# EAGLE design main (EAGLE 7.1.0)
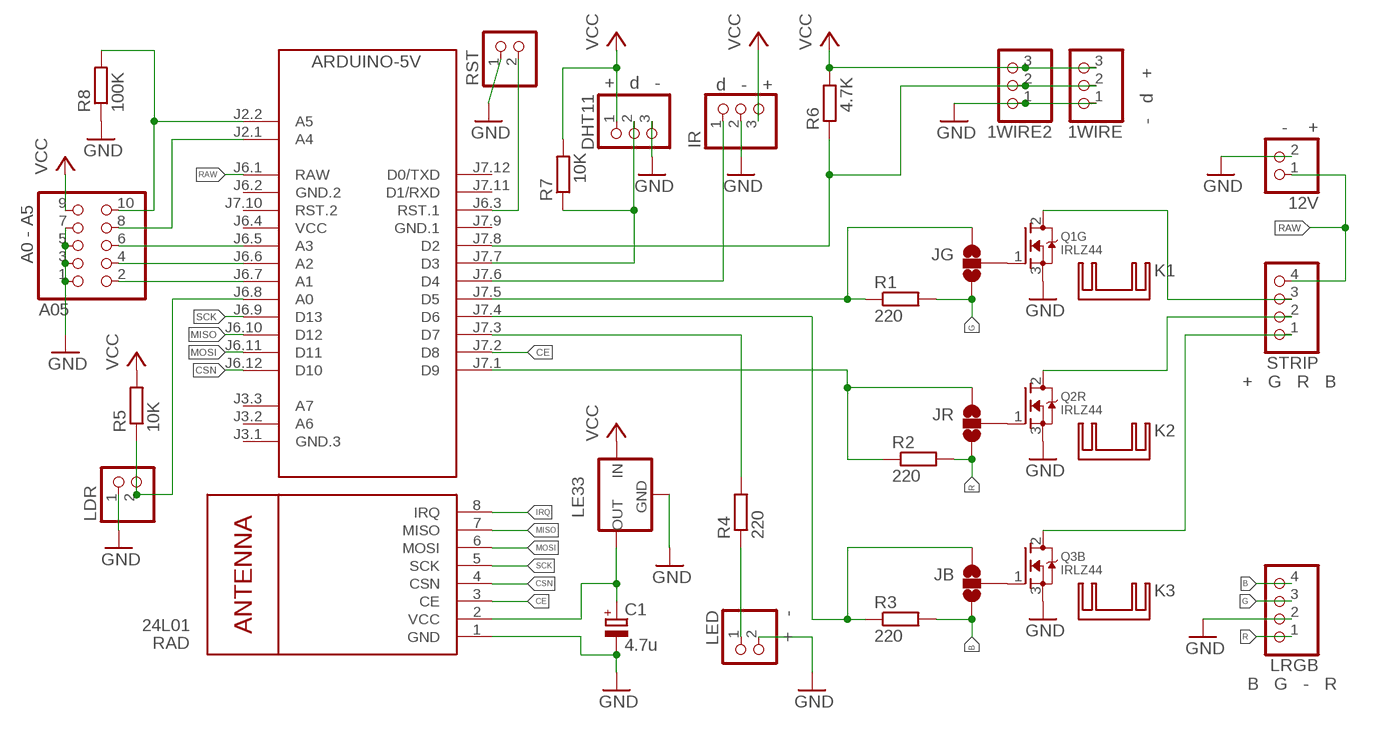
[diagram p0: schematic, sheet 1]

## Parts
1WIRE  - d +  PINHD-1X3  [1X03]
1WIRE2  PINHD-1X3  [1X03]
12V  - +  PINHD-1X2  [1X02]
A05  A0 - A5  PINHD-2X5  [2X05]
ARDUINO-5V  ARDUINO-PRO-MINI-5.0V#NP  [ARDUINO-PRO-MINI#NP]
C1  4.7u  CPOL-EUE5-6  [E5-6]
DHT11  + d -  PINHD-1X3  [1X03]
IR  d - +  PINHD-1X3  [1X03]
JB  SOLDERJUMPER_2WAYS  [SJ_3]
JG  SOLDERJUMPER_2WAYS  [SJ_3]
JR  SOLDERJUMPER_2WAYS  [SJ_3]
K1  D02S  [D02S]
K2  D02S  [D02S]
K3  D02S  [D02S]
LDR  PINHD-1X2  [1X02]
LE33  79LXX  [79LXX]
LED  + -  PINHD-1X2  [1X02]
LRGB  B G - R  PINHD-1X4  [1X04]
Q1G  IRLZ44  MOSFET-NGDS_TO220V  [TO220V]
Q2R  IRLZ44  MOSFET-NGDS_TO220V  [TO220V]
Q3B  IRLZ44  MOSFET-NGDS_TO220V  [TO220V]
R1  220  R-EU_0207/7  [0207/7]
R2  220  R-EU_0207/7  [0207/7]
R3  220  R-EU_0207/7  [0207/7]
R4  220  R-EU_0207/7  [0207/7]
R5  10K  R-EU_0207/7  [0207/7]
R6  4.7K  R-EU_0207/7  [0207/7]
R7  10K  R-EU_0207/7  [0207/7]
R8  100K  R-EU_0207/7  [0207/7]
RAD  24L01  WIRELESS-NRF24L01  [WIRELESS-NRF24L01]
RST  PINHD-1X2  [1X02]
STRIP  + G R B  PINHD-1X4  [1X04]

## Nets
B: JB.3 LRGB.4 R3.2
CE: ARDUINO-5V.J7.2(D8) RAD.3(CE)
CSN: ARDUINO-5V.J6.12(D10) RAD.4(CSN)
G: JG.3 LRGB.3 R1.2
GND: 1WIRE2.1 1WIRE.1 12V.2 A05.1 A05.3 A05.5 A05.7 C1.- DHT11.3 IR.2 LDR.1 LE33.GND LED.2 LRGB.2 Q1G.3(S) Q2R.3(S) Q3B.3(S) R8.1 RAD.1(GND) RST.1
IRQ: RAD.8(IRQ)
MISO: ARDUINO-5V.J6.10(D12) RAD.7(MISO)
MOSI: ARDUINO-5V.J6.11(D11) RAD.6(MOSI)
N$1: JB.2 Q3B.1(G)
N$2: JR.2 Q2R.1(G)
N$3: JG.2 Q1G.1(G)
N$4: ARDUINO-5V.J7.1(D9) JR.1 R2.1
N$5: ARDUINO-5V.J7.4(D6) JB.1 R3.1
N$6: LED.1 R4.1
N$7: ARDUINO-5V.J7.5(D5) JG.1 R1.1
N$8: A05.10 ARDUINO-5V.J2.2(A5) R8.2
N$9: A05.2 ARDUINO-5V.J6.7(A1)
N$10: A05.4 ARDUINO-5V.J6.6(A2)
N$11: Q1G.2(D) STRIP.3
N$12: Q3B.2(D) STRIP.1
N$13: Q2R.2(D) STRIP.2
N$14: 1WIRE2.2 1WIRE.2 ARDUINO-5V.J7.8(D2) R6.1
N$15: ARDUINO-5V.J7.6(D4) IR.1
N$16: C1.+ LE33.OUT RAD.2(VCC)
N$17: A05.6 ARDUINO-5V.J6.5(A3)
N$18: A05.8 ARDUINO-5V.J2.1(A4)
N$19: ARDUINO-5V.J6.8(A0) LDR.2 R5.1
N$20: ARDUINO-5V.J7.3(D7) R4.2
N$21: ARDUINO-5V.J7.7(D3) DHT11.2 R7.1
N$22: ARDUINO-5V.J6.3(RST.1) RST.2
R: JR.3 LRGB.1 R2.2
RAW: 12V.1 ARDUINO-5V.J6.1(RAW) STRIP.4
SCK: ARDUINO-5V.J6.9(D13) RAD.5(SCK)
VCC: 1WIRE2.3 1WIRE.3 A05.9 DHT11.1 IR.3 LE33.IN R5.2 R6.2 R7.2
Unconnected: ARDUINO-5V.J3.1(GND.3) ARDUINO-5V.J3.2(A6) ARDUINO-5V.J3.3(A7) ARDUINO-5V.J7.10(RST.2) ARDUINO-5V.J7.11(D1/RXD) ARDUINO-5V.J7.12(D0/TXD)

## Power pins joined to a net without a drawn wire
GND.1: ARDUINO-5V.J7.9(GND.1)
GND.2: ARDUINO-5V.J6.2(GND.2)
VCC: ARDUINO-5V.J6.4(VCC)

## Library data of the parts
1WIRE 1WIRE2 DHT11 IR = pinhead:PINHD-1X3: PIN HEADER
12V LDR LED RST = pinhead:PINHD-1X2: PIN HEADER
A05 = pinhead:PINHD-2X5: PIN HEADER
ARDUINO-5V = diy-modules:ARDUINO-PRO-MINI-*#NP: Arduino Pro Mini without programming pads
C1 = rcl:CPOL-EU: POLARIZED CAPACITOR, European symbol
JB JG JR = MD-Passives:SOLDERJUMPER_2WAY: Solder Jumper 2 way solder jumper
K1-K3 = heatsink:D02S: HEATSINK distributor Schukat
LE33 = v-reg-2:79LXX: VOLTAGE REGULATOR
LRGB STRIP = pinhead:PINHD-1X4: PIN HEADER
Q1G Q2R Q3B = adafruit:MOSFET-N: N-Channel Mosfet 2N7002E - 60V 260mA SOT23 [Digikey: 2N7002ET1GOSTR-ND] - REEL BSH103 - 30V 850mA SOT23 [Digikey: 568-5013-1-ND]
R1-R8 = rcl:R-EU_: RESISTOR, European symbol
RAD = diy-modules:WIRELESS-NRF24L01: 2.4 GHz Wireless Module based on NRF24L01 chip

## Board
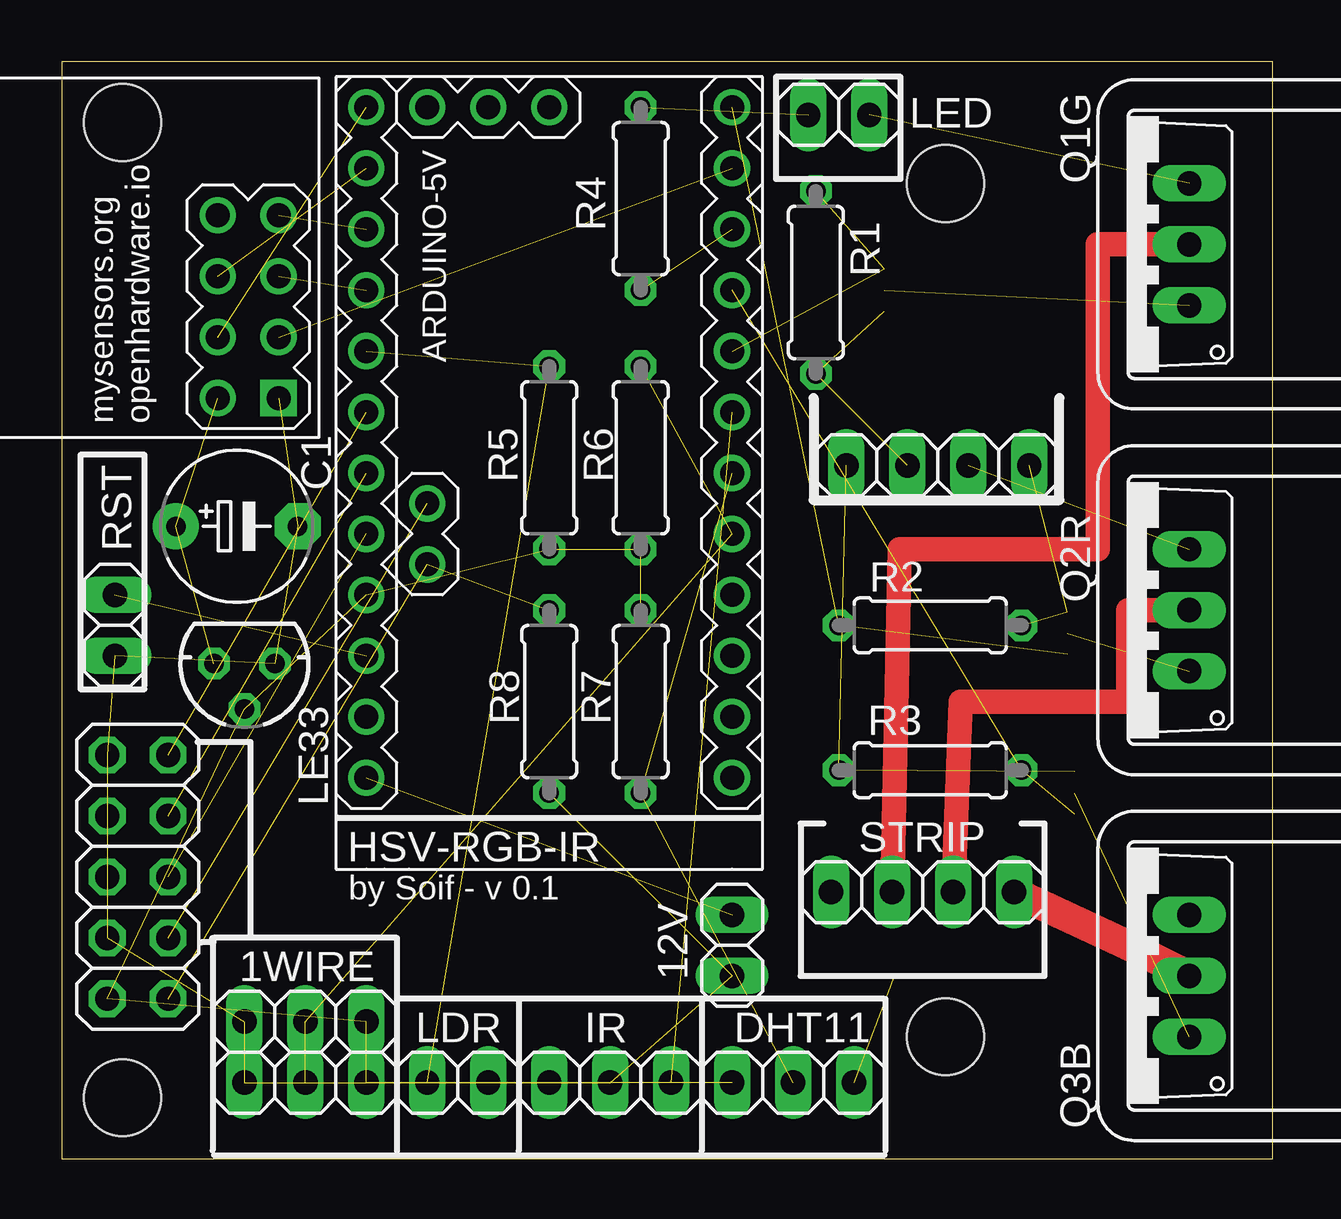
[diagram p1: board, top side]
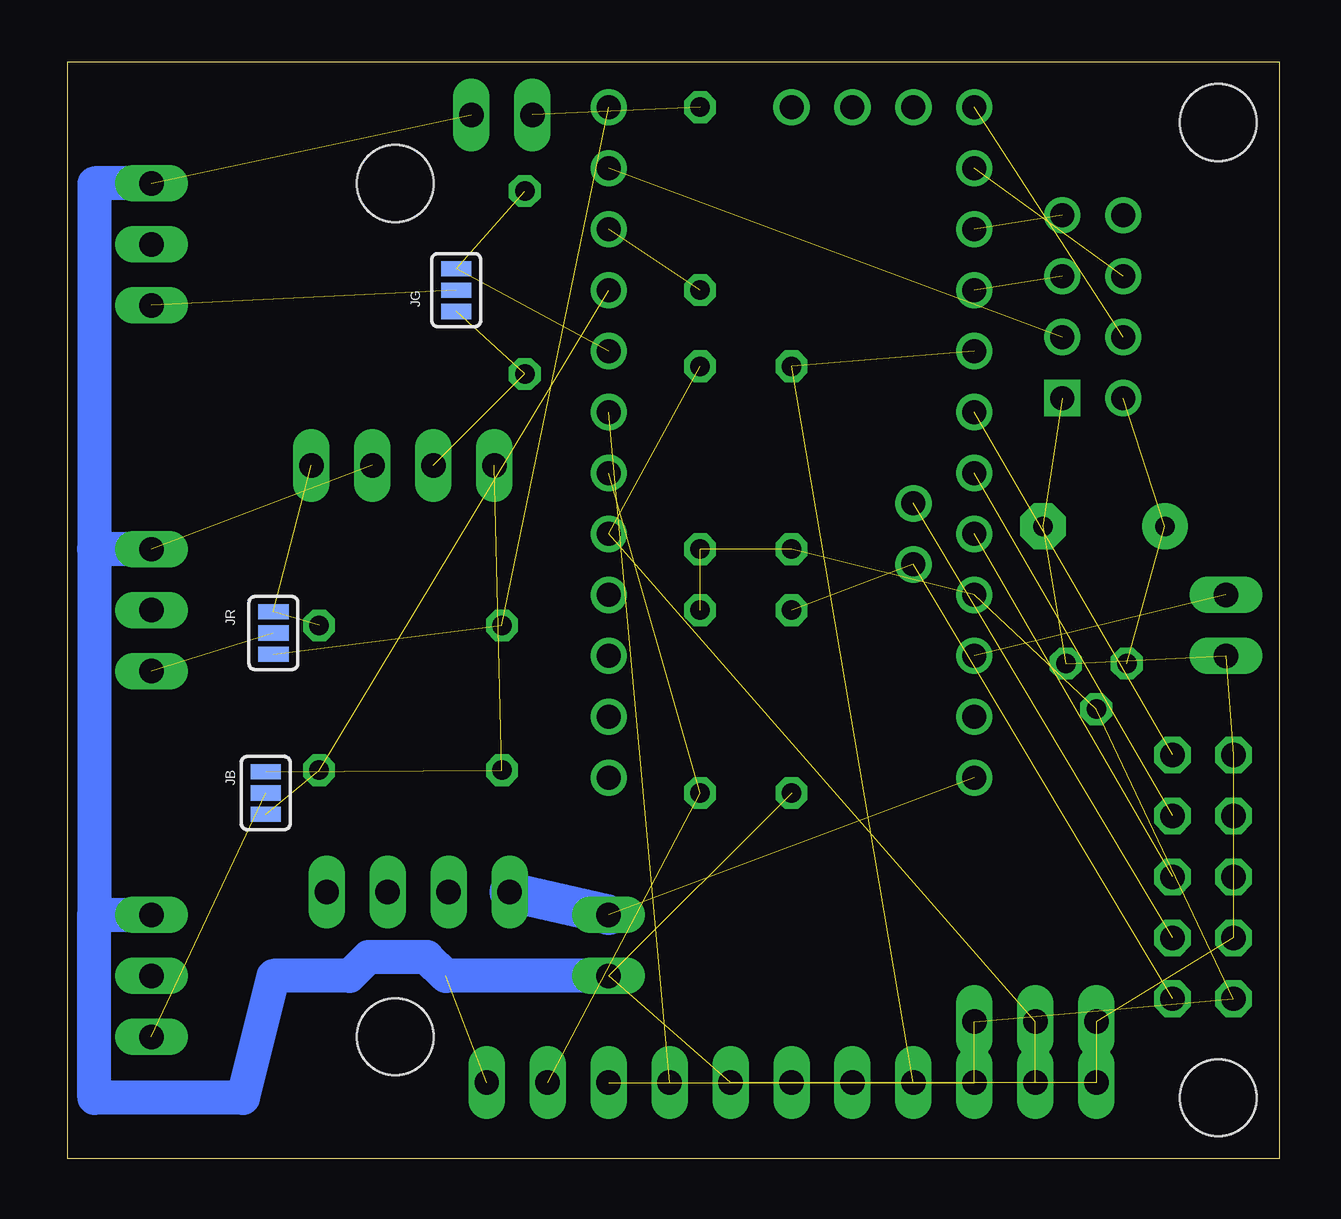
[diagram p2: board, bottom side, seen from below]

Size 50.47 x 45.71 mm. Coordinates in mm from the lower left corner, seen from the top.
Outline: 0,0 50.47,0 50.47,45.71 0,45.71 0,0
Copper layers (1*16): Top 0.035mm / dielectric 1.5mm / Bottom 0.035mm
Design rules "default": minimum track width 10mil, minimum drill 24mil, track to track 8mil, track to pad 8mil, pad to pad 8mil, via to via 8mil, smd to smd 8mil, copper to edge 40mil, drill to drill 8mil, minimum pad ring 10mil, minimum via ring 8mil, stop-mask expansion 4mil, vias tented up to drill 0mil, thermal gap 10mil
Holes 3.2 mm at 36.83,40.64 36.83,5.08 2.54,2.54 2.54,43.18

### Footprints (pad centres in the part's own frame; a part is rotated, then mirrored left to right if it is on the bottom)
1X03 = drill 1.016 long: 1 -2.54,0; 2 0,0; 3 2.54,0
1X02 = drill 1.016 long: 1 -1.27,0; 2 1.27,0
2X05 = drill 1.016 octagon: 1 -5.08,-1.27; 2 -5.08,1.27; 3 -2.54,-1.27; 4 -2.54,1.27; 5 0,-1.27; 6 0,1.27; 7 2.54,-1.27; 8 2.54,1.27; 9 5.08,-1.27; 10 5.08,1.27
ARDUINO-PRO-MINI#NP = drill 1: J2.1 -1.27,5.08; J2.2 -3.81,5.08; J3.1 15.24,0; J3.2 15.24,2.54; J3.3 15.24,5.08; J6.1 -12.7,7.62; J6.2 -10.16,7.62; J6.3 -7.62,7.62; J6.4 -5.08,7.62; J6.5 -2.54,7.62; J6.6 0,7.62; J6.7 2.54,7.62; J6.8 5.08,7.62; J6.9 7.62,7.62; J6.10 10.16,7.62; J6.11 12.7,7.62; J6.12 15.24,7.62; J7.1 15.24,-7.62; J7.2 12.7,-7.62; J7.3 10.16,-7.62; J7.4 7.62,-7.62; J7.5 5.08,-7.62; J7.6 2.54,-7.62; J7.7 0,-7.62; J7.8 -2.54,-7.62; J7.9 -5.08,-7.62; J7.10 -7.62,-7.62; J7.11 -10.16,-7.62; J7.12 -12.7,-7.62
E5-6 = drill 0.813 pad 1.905: + -2.54,0 | drill 0.813 pad 1.905 octagon: - 2.54,0
SJ_3 = smd 0.635 x 1.27: 1 -0.889,0; 2 0,0; 3 0.889,0
79LXX = drill 0.813 octagon: GND -1.27,0; IN 0,1.905; OUT 1.27,0
1X04 = drill 1.016 long: 1 -3.81,0; 2 -1.27,0; 3 1.27,0; 4 3.81,0
TO220V = drill 1.016 long: 1 -2.54,-2.54; 2 0,-2.54; 3 2.54,-2.54
0207/7 = drill 0.813 octagon: 1 -3.81,0; 2 3.81,0
WIRELESS-NRF24L01 = drill 1 square: 1 1.751,13.386 | drill 1: 2 4.291,13.386; 3 1.751,10.846; 4 4.291,10.846; 5 1.751,8.306; 6 4.291,8.306; 7 1.751,5.766; 8 4.291,5.766

### Placement (x,y rotation side)
1WIRE  10.16,3.18 0 top
1WIRE2  10.16,5.72 0 top
12V  27.94,8.89 270 top
A05  3.17,11.75 270 top
ARDUINO-5V  20.32,28.58 90 top
C1  7.3,26.35 0 top
DHT11  30.48,3.18 0 top
IR  22.86,3.18 180 top
JB  42.23,15.24 90 bottom
JG  34.29,36.2 270 bottom
JR  41.91,21.91 90 bottom
K1  44.45,38.1 270 top
K2  44.45,22.86 270 top
K3  44.45,7.62 270 top
LDR  16.51,3.18 180 top
LE33  7.62,20.64 180 top
LED  32.38,43.5 0 top
LRGB  36.51,28.89 180 top
Q1G  44.45,38.1 90 top
Q2R  44.45,22.86 90 top
Q3B  44.45,7.62 90 top
R1  31.43,36.51 270 top
R2  36.2,22.23 0 top
R3  36.2,16.19 180 top
R4  24.13,40.01 270 top
R5  20.32,29.21 270 top
R6  24.13,29.21 270 top
R7  24.13,19.05 90 top
R8  20.32,19.05 90 top
RAD  10.79,45.09 180 top
RST  2.22,22.23 90 top
STRIP  35.88,11.11 180 top

### Tracks (layer width: path | path; a pad name or v marks a point on that pad's centre or on a via)
B  (2 unrouted)
CE  (1 unrouted)
CSN  (1 unrouted)
G  (2 unrouted)
GND  (16 unrouted)
  Bottom 1.422: Q1G.3 49.37,40.64 49.38,25.4 | 49.38,25.4 49.38,10.16 | 49.38,10.16 Q3B.3 | Q2R.3 49.38,25.4 | 12V.2 34.72,7.62 35.51,8.41 37.95,8.41 38.73,7.62 41.91,7.62 43.18,2.54 49.37,2.54 49.38,10.16
MISO  (1 unrouted)
MOSI  (1 unrouted)
N$1  (1 unrouted)
N$2  (1 unrouted)
N$3  (1 unrouted)
N$4  (2 unrouted)
N$5  (2 unrouted)
N$6  (1 unrouted)
N$7  (2 unrouted)
N$8  (2 unrouted)
N$9  (1 unrouted)
N$10  (1 unrouted)
N$11
  Top 1.016: STRIP.3 34.92,25.4 43.18,25.4 43.18,38.1 Q1G.2
N$12
  Top 1.27: STRIP.1 44.45,8.89 Q3B.2
N$13
  Top 1.016: STRIP.2 37.47,19.05 44.45,19.05 44.45,22.86 Q2R.2
N$14  (3 unrouted)
N$15  (1 unrouted)
N$16  (2 unrouted)
N$17  (1 unrouted)
N$18  (1 unrouted)
N$19  (2 unrouted)
N$20  (1 unrouted)
N$21  (2 unrouted)
N$22  (1 unrouted)
R  (2 unrouted)
RAW  (1 unrouted)
  Bottom 1.676: 12V.1 STRIP.4
SCK  (1 unrouted)
VCC  (9 unrouted)

### Text on the board
tPlace: mysensors.org / openhardware.io | HSV-RGB-IR | by Soif - v 0.1